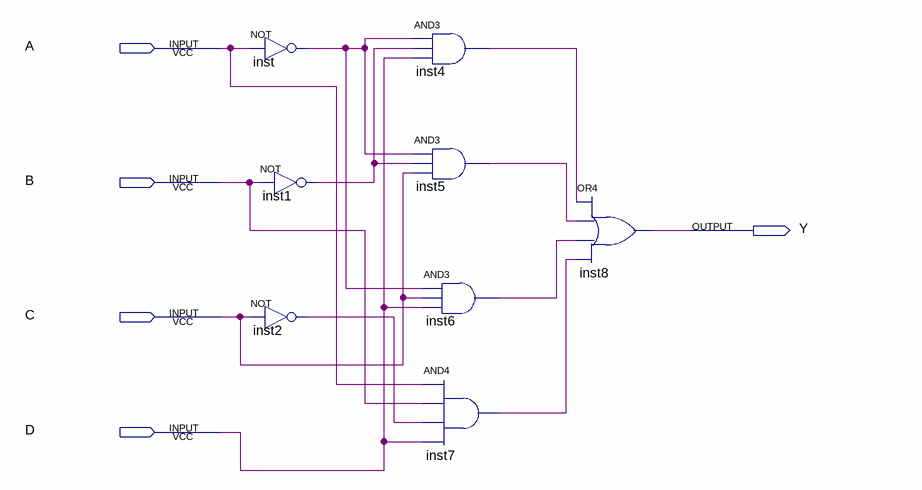
[diagram p0: schematic sheet]
// Quartus schematic circuit5.bdf as structural Verilog: 8 symbols, 5 pins
module circuit5 (
  input  A,
  input  B,
  input  C,
  input  D,
  output Y
);

  wire inst1_out, inst2_out, inst4_out, inst5_out, inst6_out, inst7_out, inst_out;

  not inst (inst_out, A);
  not inst1 (inst1_out, B);
  not inst2 (inst2_out, C);
  and inst4 (inst4_out, inst_out, inst1_out, D);
  and inst5 (inst5_out, inst_out, inst1_out, C);
  and inst6 (inst6_out, inst_out, C, D);
  and inst7 (inst7_out, A, B, inst2_out, D);
  or inst8 (Y, inst4_out, inst5_out, inst6_out, inst7_out);
endmodule
